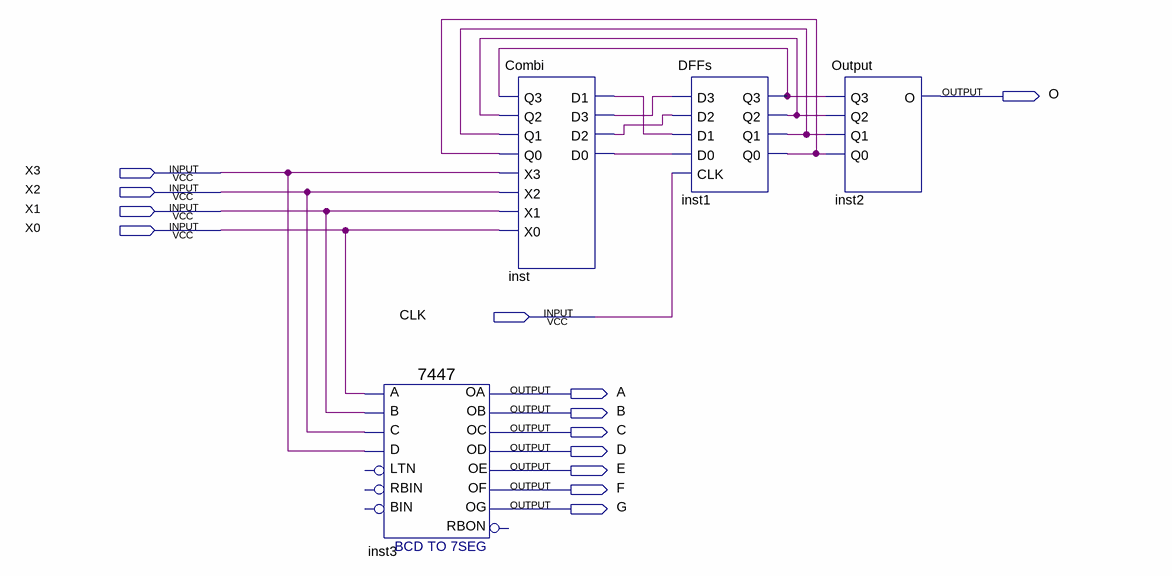
[diagram p0: schematic sheet]
// Quartus schematic MSSV.bdf as structural Verilog: 4 symbols, 13 pins
module MSSV (
  input  X3,
  input  X2,
  input  X1,
  input  X0,
  input  CLK,
  output O,
  output A,
  output B,
  output C,
  output D,
  output E,
  output F,
  output G
);

  wire inst1_q0, inst1_q1, inst1_q2, inst1_q3, inst_d0, inst_d1, inst_d2, inst_d3;

  \7447  inst3 (
    .B(X1), .C(X2), .D(X3), .A(X0), .OB(B), .OC(C), .OE(E), .OD(D), .OF(F), .OG(G), .OA(A));  // open: LTN, RBIN, BIN, RBON
  Combi inst (
    .Q3(inst1_q3), .Q2(inst1_q2), .Q1(inst1_q1), .Q0(inst1_q0), .X3(X3), .X2(X2), .X1(X1), .X0(X0),
    .D1(inst_d1), .D3(inst_d3), .D2(inst_d2), .D0(inst_d0));
  DFFs inst1 (
    .D3(inst_d3), .D2(inst_d2), .D1(inst_d1), .D0(inst_d0), .CLK(CLK), .Q3(inst1_q3), .Q2(inst1_q2),
    .Q1(inst1_q1), .Q0(inst1_q0));
  Output inst2 (.Q3(inst1_q3), .Q2(inst1_q2), .Q1(inst1_q1), .Q0(inst1_q0), .O(O));
endmodule
